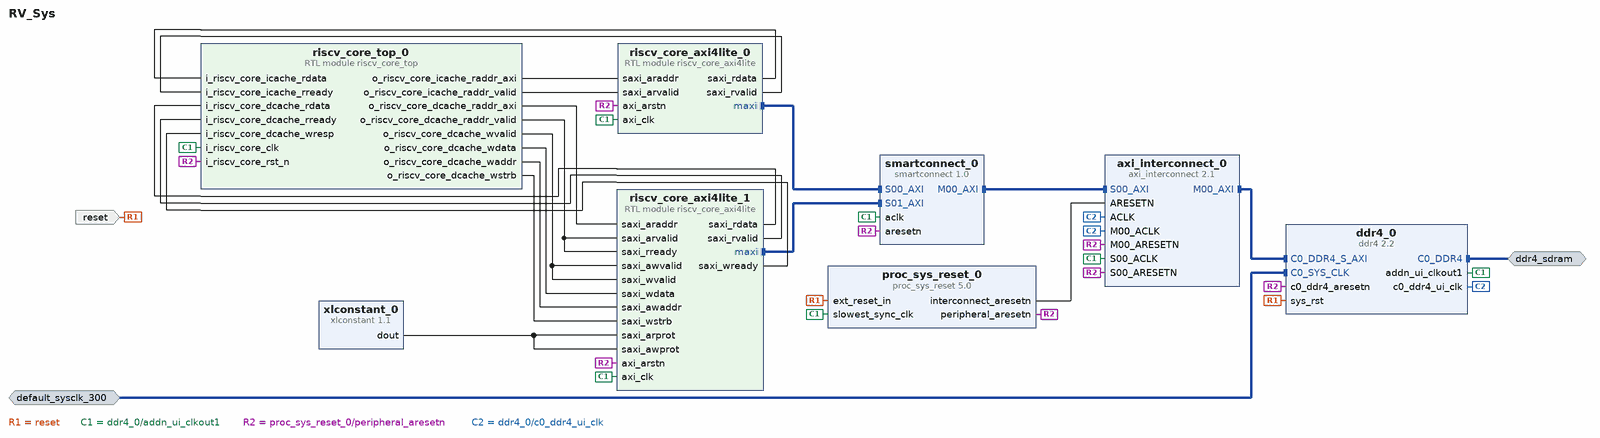
[diagram p0: block diagram of the top level]
# Vivado block design RV_Sys, xcku040-ffva1156-2-e, Vivado 2018.2
create_bd_design RV_Sys

create_bd_intf_port -mode Master -vlnv xilinx.com:interface:ddr4_rtl:1.0 ddr4_sdram
create_bd_intf_port -mode Slave -vlnv xilinx.com:interface:diff_clock_rtl:1.0 default_sysclk_300
set_property -dict {CONFIG.FREQ_HZ 300000000} [get_bd_intf_ports default_sysclk_300]
create_bd_port -dir I -type rst reset
set_property -dict {CONFIG.POLARITY ACTIVE_HIGH} [get_bd_ports reset]

create_bd_cell -type ip -vlnv xilinx.com:ip:ddr4:2.2 ddr4_0
set_property -dict [list \
  CONFIG.RESET_BOARD_INTERFACE reset \
  CONFIG.C0_CLOCK_BOARD_INTERFACE default_sysclk_300 \
  CONFIG.C0_DDR4_BOARD_INTERFACE ddr4_sdram \
  CONFIG.ADDN_UI_CLKOUT1_FREQ_HZ 100 \
] [get_bd_cells ddr4_0]
create_bd_cell -type ip -vlnv xilinx.com:ip:smartconnect:1.0 smartconnect_0
set_property -dict {CONFIG.NUM_CLKS 1} [get_bd_cells smartconnect_0]
create_bd_cell -type module -reference riscv_core_axi4lite riscv_core_axi4lite_0
create_bd_cell -type module -reference riscv_core_axi4lite riscv_core_axi4lite_1
create_bd_cell -type ip -vlnv xilinx.com:ip:xlconstant:1.1 xlconstant_0
set_property -dict {CONFIG.CONST_WIDTH 3 CONFIG.CONST_VAL 0} [get_bd_cells xlconstant_0]
create_bd_cell -type ip -vlnv xilinx.com:ip:proc_sys_reset:5.0 proc_sys_reset_0
set_property -dict [list \
  CONFIG.C_NUM_PERP_ARESETN 1 \
  CONFIG.C_NUM_INTERCONNECT_ARESETN 1 \
  CONFIG.C_NUM_PERP_RST 1 \
  CONFIG.C_NUM_BUS_RST 1 \
] [get_bd_cells proc_sys_reset_0]
create_bd_cell -type ip -vlnv xilinx.com:ip:axi_interconnect:2.1 axi_interconnect_0
set_property -dict {CONFIG.NUM_MI 1} [get_bd_cells axi_interconnect_0]
create_bd_cell -type module -reference riscv_core_top riscv_core_top_0

# ---- connections ----

connect_bd_intf_net [get_bd_intf_pins riscv_core_axi4lite_0/maxi] [get_bd_intf_pins smartconnect_0/S00_AXI]
connect_bd_intf_net [get_bd_intf_pins riscv_core_axi4lite_1/maxi] [get_bd_intf_pins smartconnect_0/S01_AXI]
connect_bd_intf_net [get_bd_intf_pins axi_interconnect_0/M00_AXI] [get_bd_intf_pins ddr4_0/C0_DDR4_S_AXI]
connect_bd_intf_net [get_bd_intf_pins axi_interconnect_0/S00_AXI] [get_bd_intf_pins smartconnect_0/M00_AXI]
connect_bd_intf_net [get_bd_intf_ports ddr4_sdram] [get_bd_intf_pins ddr4_0/C0_DDR4]
connect_bd_intf_net -intf_net default_sysclk_300_1 [get_bd_intf_ports default_sysclk_300] [get_bd_intf_pins ddr4_0/C0_SYS_CLK]
connect_bd_net [get_bd_ports reset] [get_bd_pins ddr4_0/sys_rst] [get_bd_pins proc_sys_reset_0/ext_reset_in]
connect_bd_net [get_bd_pins riscv_core_top_0/o_riscv_core_icache_raddr_axi] [get_bd_pins riscv_core_axi4lite_0/saxi_araddr]
connect_bd_net [get_bd_pins riscv_core_top_0/o_riscv_core_icache_raddr_valid] [get_bd_pins riscv_core_axi4lite_0/saxi_arvalid]
connect_bd_net [get_bd_pins riscv_core_axi4lite_0/saxi_rdata] [get_bd_pins riscv_core_top_0/i_riscv_core_icache_rdata]
connect_bd_net [get_bd_pins riscv_core_axi4lite_0/saxi_rvalid] [get_bd_pins riscv_core_top_0/i_riscv_core_icache_rready]
connect_bd_net [get_bd_pins riscv_core_top_0/o_riscv_core_dcache_raddr_axi] [get_bd_pins riscv_core_axi4lite_1/saxi_araddr]
connect_bd_net [get_bd_pins riscv_core_top_0/o_riscv_core_dcache_raddr_valid] \
  [get_bd_pins riscv_core_axi4lite_1/saxi_arvalid] [get_bd_pins riscv_core_axi4lite_1/saxi_rready]
connect_bd_net [get_bd_pins riscv_core_top_0/o_riscv_core_dcache_wvalid] \
  [get_bd_pins riscv_core_axi4lite_1/saxi_wvalid] [get_bd_pins riscv_core_axi4lite_1/saxi_awvalid]
connect_bd_net [get_bd_pins riscv_core_top_0/o_riscv_core_dcache_wdata] [get_bd_pins riscv_core_axi4lite_1/saxi_wdata]
connect_bd_net [get_bd_pins riscv_core_top_0/o_riscv_core_dcache_waddr] [get_bd_pins riscv_core_axi4lite_1/saxi_awaddr]
connect_bd_net [get_bd_pins riscv_core_top_0/o_riscv_core_dcache_wstrb] [get_bd_pins riscv_core_axi4lite_1/saxi_wstrb]
connect_bd_net [get_bd_pins riscv_core_axi4lite_1/saxi_rdata] [get_bd_pins riscv_core_top_0/i_riscv_core_dcache_rdata]
connect_bd_net [get_bd_pins riscv_core_axi4lite_1/saxi_rvalid] [get_bd_pins riscv_core_top_0/i_riscv_core_dcache_rready]
connect_bd_net [get_bd_pins xlconstant_0/dout] [get_bd_pins riscv_core_axi4lite_1/saxi_arprot] [get_bd_pins riscv_core_axi4lite_1/saxi_awprot]
connect_bd_net [get_bd_pins riscv_core_axi4lite_1/saxi_wready] [get_bd_pins riscv_core_top_0/i_riscv_core_dcache_wresp]
connect_bd_net [get_bd_pins ddr4_0/addn_ui_clkout1] \
  [get_bd_pins smartconnect_0/aclk] [get_bd_pins riscv_core_axi4lite_0/axi_clk] [get_bd_pins riscv_core_axi4lite_1/axi_clk] \
  [get_bd_pins proc_sys_reset_0/slowest_sync_clk] [get_bd_pins axi_interconnect_0/S00_ACLK] \
  [get_bd_pins riscv_core_top_0/i_riscv_core_clk]
connect_bd_net [get_bd_pins proc_sys_reset_0/peripheral_aresetn] \
  [get_bd_pins ddr4_0/c0_ddr4_aresetn] [get_bd_pins smartconnect_0/aresetn] [get_bd_pins riscv_core_axi4lite_0/axi_arstn] \
  [get_bd_pins riscv_core_axi4lite_1/axi_arstn] [get_bd_pins axi_interconnect_0/S00_ARESETN] \
  [get_bd_pins axi_interconnect_0/M00_ARESETN] [get_bd_pins riscv_core_top_0/i_riscv_core_rst_n]
connect_bd_net [get_bd_pins ddr4_0/c0_ddr4_ui_clk] [get_bd_pins axi_interconnect_0/M00_ACLK] [get_bd_pins axi_interconnect_0/ACLK]
connect_bd_net -net ARESETN_1 [get_bd_pins proc_sys_reset_0/interconnect_aresetn] [get_bd_pins axi_interconnect_0/ARESETN]

# ---- address map ----
assign_bd_address -offset 0x0000000080000000 -range 2G -target_address_space [get_bd_addr_spaces riscv_core_axi4lite_0/maxi] [get_bd_addr_segs ddr4_0/C0_DDR4_MEMORY_MAP/C0_DDR4_ADDRESS_BLOCK]
assign_bd_address -offset 0x0000000080000000 -range 2G -target_address_space [get_bd_addr_spaces riscv_core_axi4lite_1/maxi] [get_bd_addr_segs ddr4_0/C0_DDR4_MEMORY_MAP/C0_DDR4_ADDRESS_BLOCK]

validate_bd_design
save_bd_design
